# Altium schematic sheet Motor2.SchDoc
size A4
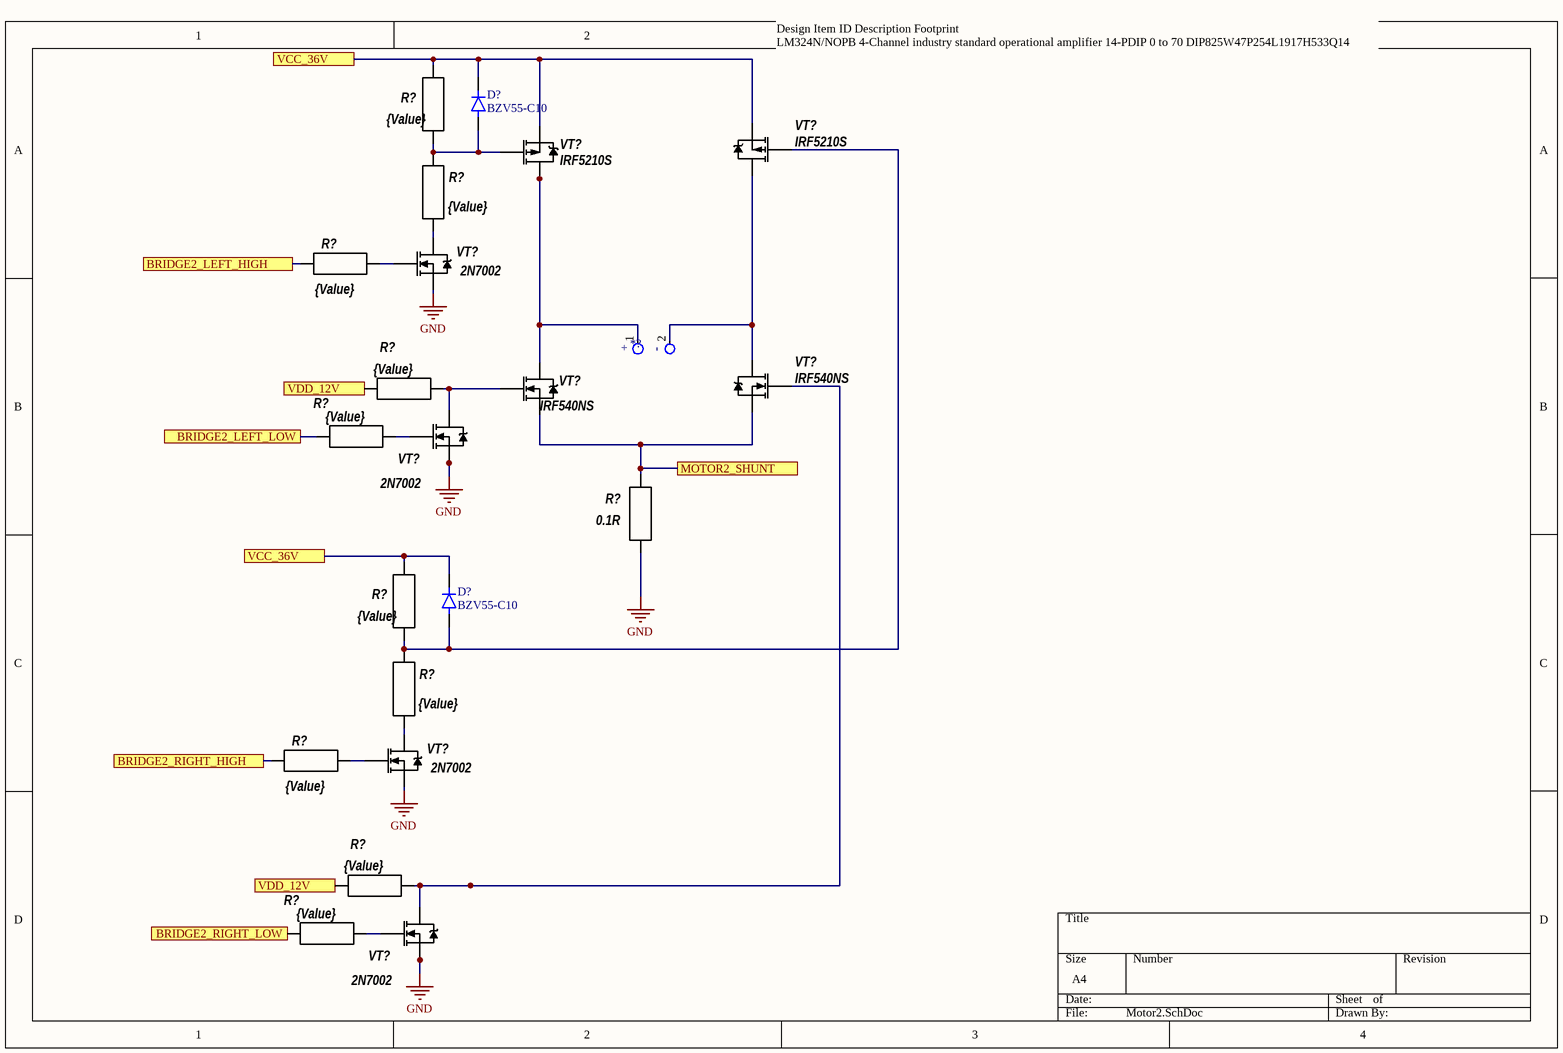
[diagram p0: Motor2.SchDoc]

## Parts
(Parts that share a designator on the sheet are numbered #1, #2 ... from top to bottom, then left to right.)
*?  Motor  [Power connector 2 pin]  (value not drawn)
D?#1  BZV55-C10  [DIO_LL4148]
D?#2  BZV55-C10  [DIO_LL4148]
R?#1  value {Value}  [R0805]  (hidden comment: Res 0805)
R?#2  value {Value}  [R0805]  (hidden comment: Res 0805)
R?#3  value {Value}  [R0805]  (hidden comment: Res 0805)
R?#4  value {Value}  [R0805]  (hidden comment: Res 0805)
R?#5  value {Value}  [R0805]  (hidden comment: Res 0805)
R?#6  value 0.1R  [R2512]  (hidden comment: Res 2512)
R?#7  value {Value}  [R0805]  (hidden comment: Res 0805)
R?#8  value {Value}  [R0805]  (hidden comment: Res 0805)
R?#9  value {Value}  [R0805]  (hidden comment: Res 0805)
R?#10  value {Value}  [R0805]  (hidden comment: Res 0805)
R?#11  value {Value}  [R0805]  (hidden comment: Res 0805)
VT?#1  IRF5210S  [D2Pak]
VT?#2  IRF5210S  [D2Pak]
VT?#3  2N7002  [SOT-23]
VT?#4  IRF540NS  [D2Pak]
VT?#5  IRF540NS  [D2Pak]
VT?#6  2N7002  [SOT-23]
VT?#7  2N7002  [SOT-23]
VT?#8  2N7002  [SOT-23]

## Ports
BRIDGE2_LEFT_HIGH, BRIDGE2_LEFT_LOW, BRIDGE2_RIGHT_HIGH, BRIDGE2_RIGHT_LOW, MOTOR2_SHUNT, VCC_36V, VDD_12V

## Nets
GND: R?#6.1 VT?#3.2(S) VT?#6.2(S) VT?#7.2(S) VT?#8.2(S)
BRIDGE2_LEFT_HIGH: R?#3.2 ; port BRIDGE2_LEFT_HIGH
BRIDGE2_LEFT_LOW: R?#5.1 ; port BRIDGE2_LEFT_LOW
BRIDGE2_RIGHT_HIGH: R?#9.2 ; port BRIDGE2_RIGHT_HIGH
BRIDGE2_RIGHT_LOW: R?#11.1 ; port BRIDGE2_RIGHT_LOW
MOTOR2_SHUNT: R?#6.2 VT?#4.3(S) VT?#5.3(S) ; port MOTOR2_SHUNT
VCC_36V: D?#1.C D?#2.C R?#1.2 R?#7.2 VT?#1.3(S) VT?#2.3(S) ; port VCC_36V
VDD_12V: R?#4.1 R?#10.1 ; port VDD_12V
Net*?_1: *?.1 VT?#1.2(D) VT?#4.2(D)
Net*?_2: *?.2 VT?#2.2(D) VT?#5.2(D)
NetD?#1_A: D?#1.A R?#1.1 R?#2.2 VT?#1.1(G)
NetD?#2_A: D?#2.A R?#7.1 R?#8.2 VT?#2.1(G)
NetR?#2_1: R?#2.1 VT?#3.3(D)
NetR?#3_1: R?#3.1 VT?#3.1(G)
NetR?#4_2: R?#4.2 VT?#4.1(G) VT?#6.3(D)
NetR?#5_2: R?#5.2 VT?#6.1(G)
NetR?#8_1: R?#8.1 VT?#7.3(D)
NetR?#9_1: R?#9.1 VT?#7.1(G)
NetR?#10_2: R?#10.2 VT?#5.1(G) VT?#8.3(D)
NetR?#11_2: R?#11.2 VT?#8.1(G)

## Notes on the sheet
- Design Item ID	Description	Footprint
  LM324N/NOPB	4-Channel industry standard operational amplifier 14-PDIP 0 to 70	DIP825W47P254L1917H533Q14
- (in symbol Power connector 2pin) +; -

## Library data of the parts
*? = Power connector 2pin
D?#1 D?#2 = LL4148: Diode Standard 100V 200mA Surface Mount SOD-80; MF: ON Semiconductor; Package: SOD-80 Taitron; Availability: Unavailable; MP: LL4148; Value: *; SnapEDA_Link: https://www.snapeda.com/parts/LL4148/ON%20Semiconductor/view-part/2182678/?ref=snap; Price: None
R?#1-R?#5 R?#7-R?#11 = Res 0805: Резистор 0805; Manufacturer: Yageo; sm_pins: 2; th_pins: 0; Model: *
R?#6 = Res 2512: Резистор 2512; Manufacturer: Yageo; sm_pins: 2; th_pins: 0; Model: 2512
VT?#1 VT?#2 = IRF5210S: P-chanel, 100V, 40A, 60 mOhm; Manufacturer: International Rectifier; Model: IRF5210SPBF
VT?#3 VT?#6-VT?#8 = 2N7002: 60V, 200 mA, N-chanel; Manufacturer: ON Semiconductor; sm_pins: 3; th_pins: 0; Model: 2N7002LT1G
VT?#4 VT?#5 = STB21NM60ND: D2pak, 600V, 17А, 170 mOhm; Manufacturer: ST Microelectronics; Model: STB21NM60ND